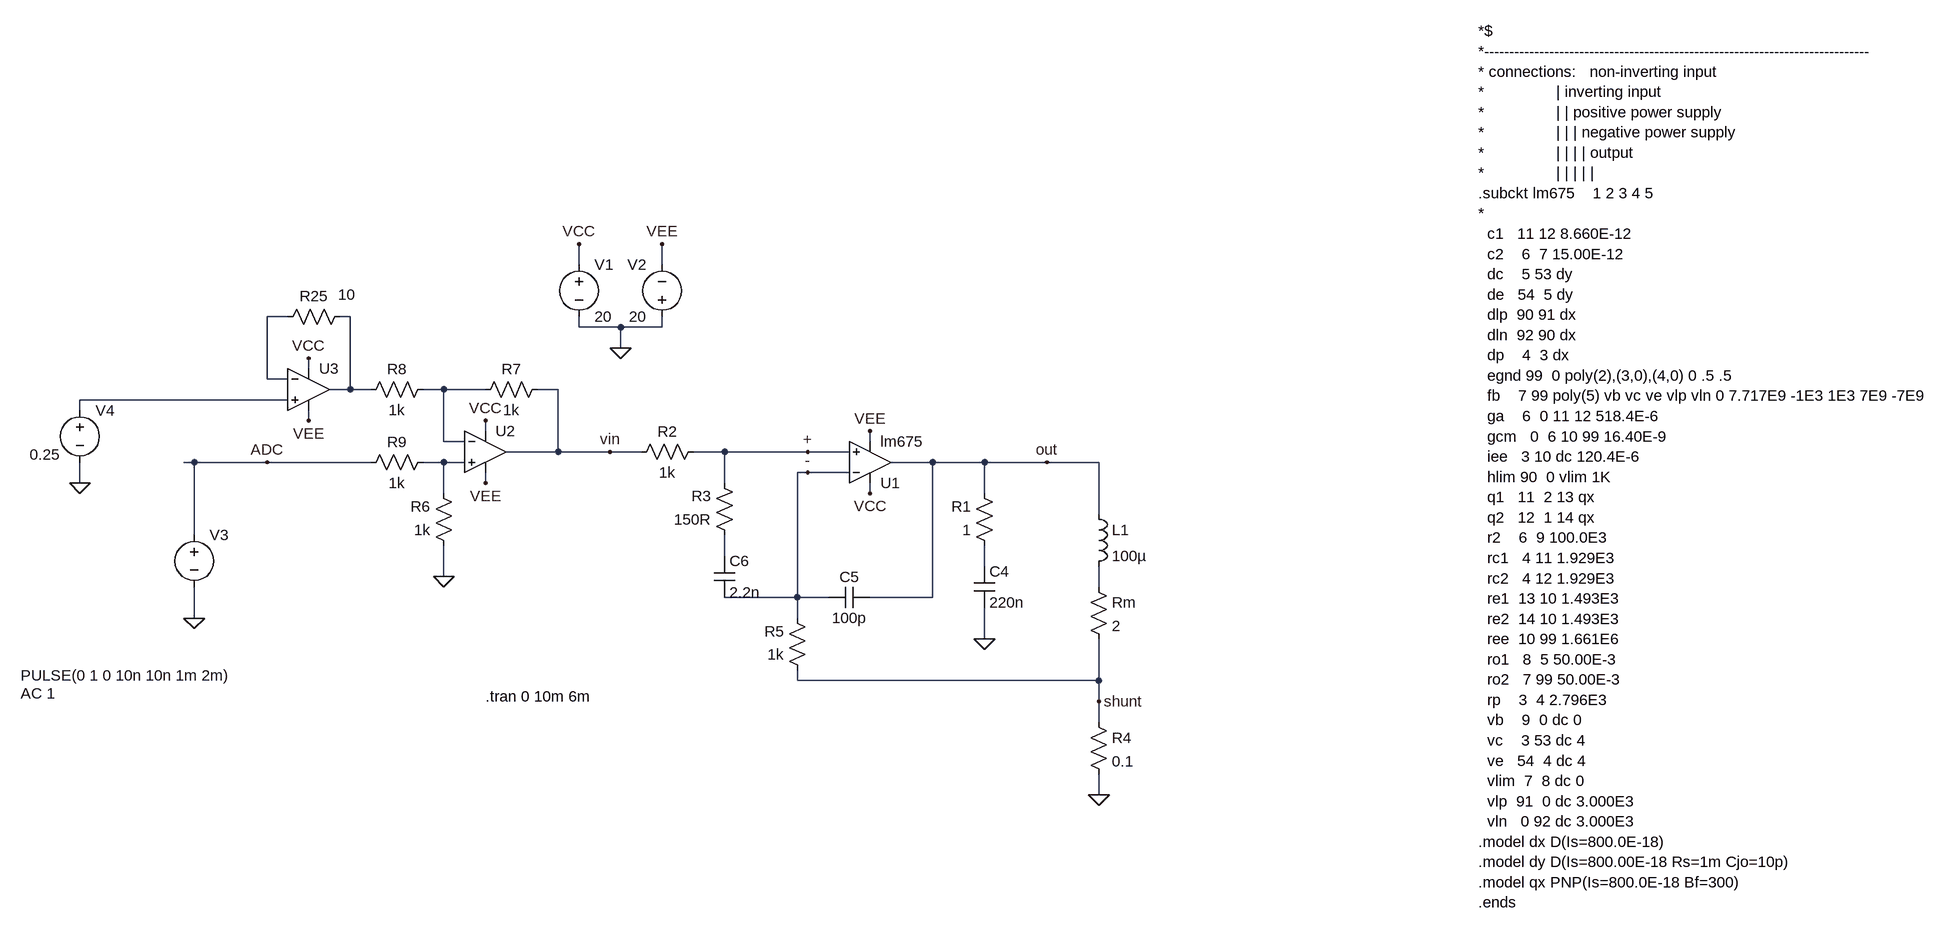
[diagram p0: schematic endstufe.asc]
endstufe.asc, the LTspice schematic file:
Version 4
SHEET 1 1996 680
WIRE -192 -352 -192 -384
WIRE -64 -352 -64 -384
WIRE -640 -272 -672 -272
WIRE -544 -272 -560 -272
WIRE -192 -256 -192 -272
WIRE -128 -256 -192 -256
WIRE -64 -256 -64 -272
WIRE -64 -256 -128 -256
WIRE -128 -224 -128 -256
WIRE -608 -192 -608 -208
WIRE -672 -176 -672 -272
WIRE -640 -176 -672 -176
WIRE -544 -160 -544 -272
WIRE -544 -160 -576 -160
WIRE -512 -160 -544 -160
WIRE -400 -160 -432 -160
WIRE -336 -160 -400 -160
WIRE -224 -160 -256 -160
WIRE -640 -144 -960 -144
WIRE -960 -128 -960 -144
WIRE -608 -112 -608 -128
WIRE -336 -96 -336 -112
WIRE -400 -80 -400 -160
WIRE -368 -80 -400 -80
WIRE 256 -80 256 -96
WIRE -224 -64 -224 -160
WIRE -224 -64 -304 -64
WIRE -144 -64 -224 -64
WIRE -96 -64 -144 -64
WIRE 32 -64 -16 -64
WIRE 160 -64 32 -64
WIRE 224 -64 160 -64
WIRE -784 -48 -800 -48
WIRE -672 -48 -784 -48
WIRE -512 -48 -672 -48
WIRE -400 -48 -432 -48
WIRE -368 -48 -400 -48
WIRE 352 -48 288 -48
WIRE 432 -48 352 -48
WIRE 528 -48 432 -48
WIRE 608 -48 528 -48
WIRE 160 -32 144 -32
WIRE 224 -32 160 -32
WIRE -960 -16 -960 -48
WIRE -336 -16 -336 -32
WIRE 32 -16 32 -64
WIRE -400 0 -400 -48
WIRE 256 0 256 -16
WIRE 432 0 432 -48
WIRE 608 32 608 -48
WIRE -784 64 -784 -48
WIRE 32 96 32 64
WIRE 432 112 432 80
WIRE -400 128 -400 80
WIRE 608 144 608 112
WIRE 144 160 144 -32
WIRE 144 160 32 160
WIRE 192 160 144 160
WIRE 352 160 352 -48
WIRE 352 160 256 160
WIRE -784 192 -784 144
WIRE 144 192 144 160
WIRE 432 224 432 176
WIRE 144 288 144 272
WIRE 608 288 608 224
WIRE 608 288 144 288
WIRE 608 320 608 288
WIRE 608 352 608 320
WIRE 608 464 608 432
FLAG 432 224 0
FLAG 608 464 0
FLAG 256 -96 VEE
FLAG 256 0 VCC
FLAG -128 -224 0
FLAG -784 192 0
FLAG -64 -384 VEE
FLAG -192 -384 VCC
FLAG -144 -64 vin
FLAG 528 -48 out
FLAG 608 320 shunt
FLAG 160 -64 +
FLAG 160 -32 -
FLAG -400 128 0
FLAG -336 -16 VEE
FLAG -608 -112 VEE
FLAG -336 -112 VCC
FLAG -608 -208 VCC
FLAG -960 -16 0
FLAG -672 -48 ADC
SYMBOL res 0 -80 R90
WINDOW 0 0 56 VBottom 2
WINDOW 3 32 56 VTop 2
SYMATTR InstName R2
SYMATTR Value 1k
SYMBOL res 48 80 R180
WINDOW 0 36 76 Left 2
WINDOW 3 36 40 Left 2
SYMATTR InstName R3
SYMATTR Value 150R
SYMBOL res 160 288 R180
WINDOW 0 36 76 Left 2
WINDOW 3 36 40 Left 2
SYMATTR InstName R5
SYMATTR Value 1k
SYMBOL res 448 96 R180
WINDOW 0 36 76 Left 2
WINDOW 3 36 40 Left 2
SYMATTR InstName R1
SYMATTR Value 1
SYMBOL cap 416 112 R0
SYMATTR InstName C4
SYMATTR Value 220n
SYMBOL cap 16 96 R0
SYMATTR InstName C6
SYMATTR Value 2.2n
SYMBOL cap 256 144 R90
WINDOW 0 0 32 VBottom 2
WINDOW 3 32 32 VTop 2
SYMATTR InstName C5
SYMATTR Value 100p
SYMBOL ind 592 16 R0
SYMATTR InstName L1
SYMATTR Value 100µ
SYMBOL res 592 336 R0
SYMATTR InstName R4
SYMATTR Value 0.1
SYMBOL voltage -192 -368 R0
WINDOW 123 0 0 Left 2
WINDOW 39 0 0 Left 2
SYMATTR InstName V1
SYMATTR Value 20
SYMBOL voltage -64 -256 R180
WINDOW 0 24 96 Left 2
WINDOW 3 24 16 Left 2
WINDOW 123 0 0 Left 2
WINDOW 39 0 0 Left 2
SYMATTR InstName V2
SYMATTR Value 20
SYMBOL voltage -784 48 R0
WINDOW 3 -267 232 Left 2
WINDOW 123 -267 260 Left 2
WINDOW 39 0 0 Left 2
SYMATTR Value PULSE(0 1 0 10n 10n 1m 2m)
SYMATTR Value2 AC 1
SYMATTR InstName V3
SYMBOL res 592 128 R0
SYMATTR InstName Rm
SYMATTR Value 2
SYMBOL Opamps\\opamp2 256 16 M180
SYMATTR InstName U1
SYMATTR Value lm675
SYMBOL res -544 -288 R90
WINDOW 0 0 56 VBottom 2
WINDOW 3 -34 5 VTop 2
SYMATTR InstName R25
SYMATTR Value 10
SYMBOL res -416 -176 R90
WINDOW 0 0 56 VBottom 2
WINDOW 3 32 56 VTop 2
SYMATTR InstName R8
SYMATTR Value 1k
SYMBOL res -240 -176 R90
WINDOW 0 0 56 VBottom 2
WINDOW 3 32 56 VTop 2
SYMATTR InstName R7
SYMATTR Value 1k
SYMBOL res -416 -64 R90
WINDOW 0 0 56 VBottom 2
WINDOW 3 32 56 VTop 2
SYMATTR InstName R9
SYMATTR Value 1k
SYMBOL res -384 96 R180
WINDOW 0 36 76 Left 2
WINDOW 3 36 40 Left 2
SYMATTR InstName R6
SYMATTR Value 1k
SYMBOL voltage -960 -144 R0
WINDOW 3 -77 84 Left 2
WINDOW 123 0 0 Left 2
WINDOW 39 0 0 Left 2
SYMATTR Value 0.25
SYMATTR InstName V4
SYMBOL Opamps\\UniversalOpamp2 -336 -64 R0
SYMATTR InstName U2
SYMBOL Opamps\\UniversalOpamp2 -608 -160 R0
SYMATTR InstName U3
TEXT -336 312 Left 2 !.tran 0 10m 6m
TEXT 1192 -712 Left 2 !*$\n*-----------------------------------------------------------------------------\n* connections:   non-inverting input\n*                | inverting input\n*                | | positive power supply\n*                | | | negative power supply\n*                | | | | output\n*                | | | | |\n.subckt lm675    1 2 3 4 5\n*\n  c1   11 12 8.660E-12\n  c2    6  7 15.00E-12\n  dc    5 53 dy\n  de   54  5 dy\n  dlp  90 91 dx\n  dln  92 90 dx\n  dp    4  3 dx\n  egnd 99  0 poly(2),(3,0),(4,0) 0 .5 .5\n  fb    7 99 poly(5) vb vc ve vlp vln 0 7.717E9 -1E3 1E3 7E9 -7E9\n  ga    6  0 11 12 518.4E-6\n  gcm   0  6 10 99 16.40E-9\n  iee   3 10 dc 120.4E-6\n  hlim 90  0 vlim 1K\n  q1   11  2 13 qx\n  q2   12  1 14 qx\n  r2    6  9 100.0E3\n  rc1   4 11 1.929E3\n  rc2   4 12 1.929E3\n  re1  13 10 1.493E3\n  re2  14 10 1.493E3\n  ree  10 99 1.661E6\n  ro1   8  5 50.00E-3\n  ro2   7 99 50.00E-3\n  rp    3  4 2.796E3\n  vb    9  0 dc 0\n  vc    3 53 dc 4\n  ve   54  4 dc 4\n  vlim  7  8 dc 0\n  vlp  91  0 dc 3.000E3\n  vln   0 92 dc 3.000E3\n.model dx D(Is=800.0E-18)\n.model dy D(Is=800.00E-18 Rs=1m Cjo=10p)\n.model qx PNP(Is=800.0E-18 Bf=300)\n.ends

The netlist it stands for:
* endstufe.asc
R2 + vin 1k
R3 N006 + 150R
R5 shunt - 1k
R1 N007 out 1
C4 N007 0 220n
C6 N006 - 2.2n
C5 out - 100p
L1 out N008 100µ
R4 shunt 0 0.1
V1 VCC 0 20
V2 0 VEE 20
V3 ADC 0 PULSE(0 1 0 10n 10n 1m 2m) AC 1
Rm N008 shunt 2
XU1 + - VCC VEE out lm675  ; pins In+ In- V+ V- OUT
R25 N002 N001 10
R8 N003 N002 1k
R7 vin N003 1k
R9 N005 ADC 1k
R6 0 N005 1k
V4 N004 0 0.25
XU2 N005 N003 VCC VEE vin level.2 Avol=1Meg GBW=10Meg Slew=10Meg ilimit=25m rail=0 Vos=0 phimargin=45 en=0 enk=0 in=0 ink=0 Rin=500Meg  ; pins IN+ IN- V+ V- OUT
XU3 N004 N001 VCC VEE N002 level.2 Avol=1Meg GBW=10Meg Slew=10Meg ilimit=25m rail=0 Vos=0 phimargin=45 en=0 enk=0 in=0 ink=0 Rin=500Meg  ; pins IN+ IN- V+ V- OUT
.tran 0 10m 6m
*$
*-----------------------------------------------------------------------------
* connections:   non-inverting input
*                | inverting input
*                | | positive power supply
*                | | | negative power supply
*                | | | | output
*                | | | | |
.subckt lm675    1 2 3 4 5
*
  c1   11 12 8.660E-12
  c2    6  7 15.00E-12
  dc    5 53 dy
  de   54  5 dy
  dlp  90 91 dx
  dln  92 90 dx
  dp    4  3 dx
  egnd 99  0 poly(2),(3,0),(4,0) 0 .5 .5
  fb    7 99 poly(5) vb vc ve vlp vln 0 7.717E9 -1E3 1E3 7E9 -7E9
  ga    6  0 11 12 518.4E-6
  gcm   0  6 10 99 16.40E-9
  iee   3 10 dc 120.4E-6
  hlim 90  0 vlim 1K
  q1   11  2 13 qx
  q2   12  1 14 qx
  r2    6  9 100.0E3
  rc1   4 11 1.929E3
  rc2   4 12 1.929E3
  re1  13 10 1.493E3
  re2  14 10 1.493E3
  ree  10 99 1.661E6
  ro1   8  5 50.00E-3
  ro2   7 99 50.00E-3
  rp    3  4 2.796E3
  vb    9  0 dc 0
  vc    3 53 dc 4
  ve   54  4 dc 4
  vlim  7  8 dc 0
  vlp  91  0 dc 3.000E3
  vln   0 92 dc 3.000E3
.model dx D(Is=800.0E-18)
.model dy D(Is=800.00E-18 Rs=1m Cjo=10p)
.model qx PNP(Is=800.0E-18 Bf=300)
.ends
.lib UniversalOpamps2.sub
.backanno
.end